# EAGLE design PDD (EAGLE 6.2)
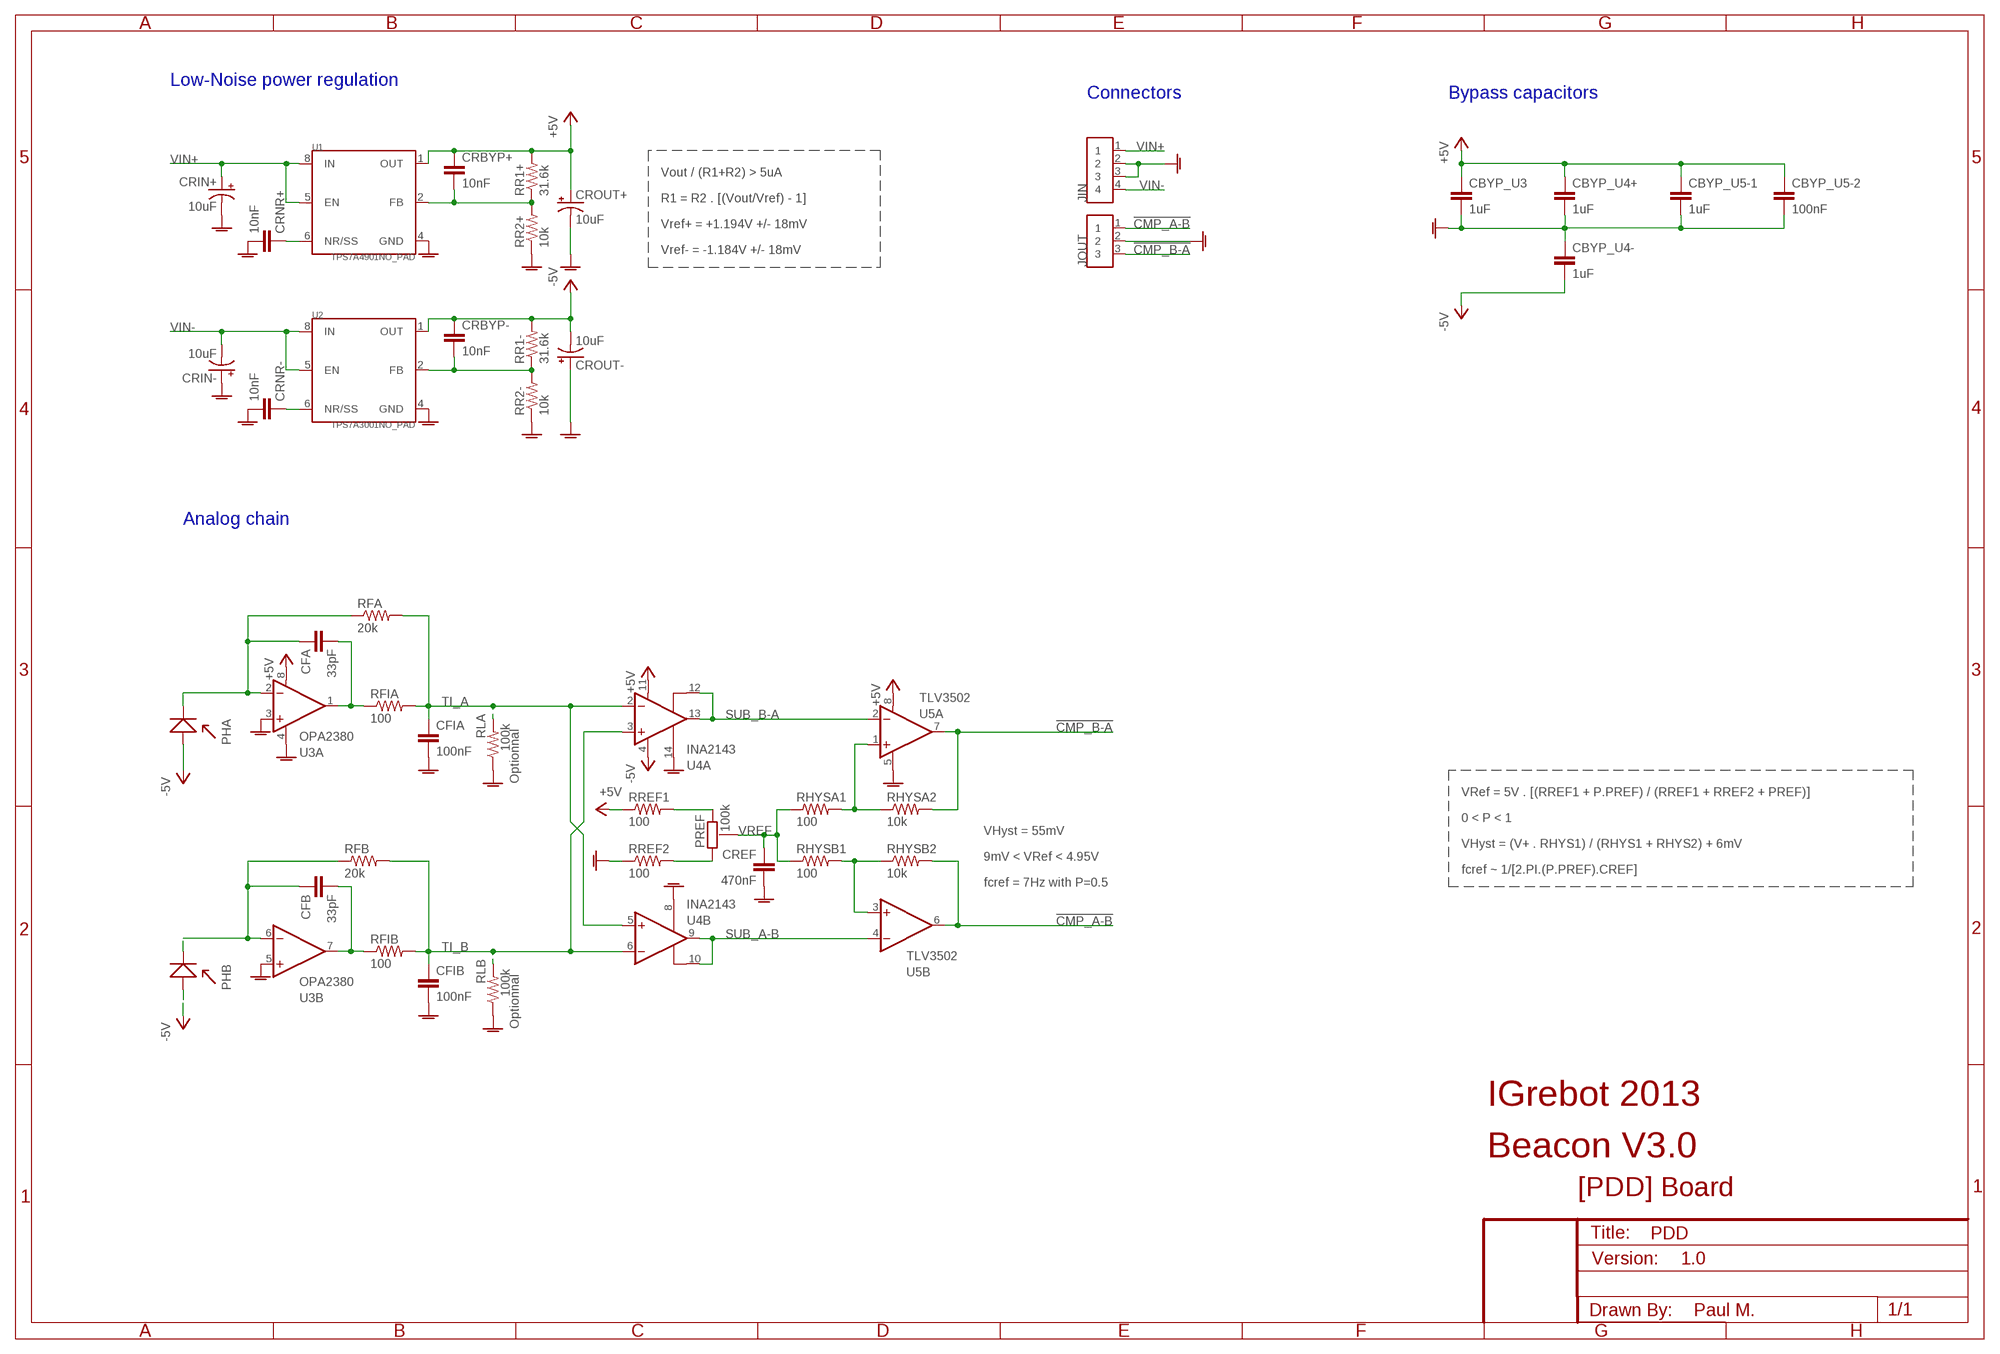
[diagram p0: schematic, sheet 1]

## Parts
CBYP_U3  1uF  CAP0603-CAP  [0603-CAP]
CBYP_U4+  1uF  CAP0603-CAP  [0603-CAP]
CBYP_U4-  1uF  CAP0603-CAP  [0603-CAP]
CBYP_U5-1  1uF  CAP0603-CAP  [0603-CAP]
CBYP_U5-2  100nF  CAP0603-CAP  [0603-CAP]
CFA  33pF  CAP0603-CAP  [0603-CAP]
CFB  33pF  CAP0603-CAP  [0603-CAP]
CFIA  100nF  CAP0603-CAP  [0603-CAP]
CFIB  100nF  CAP0603-CAP  [0603-CAP]
CRBYP+  10nF  CAP0603-CAP  [0603-CAP]
CRBYP-  10nF  CAP0603-CAP  [0603-CAP]
CREF  470nF  CAP0603-CAP  [0603-CAP]
CRIN+  10uF  CAP_POL3528-KIT  [EIA3528-KIT]
CRIN-  10uF  CAP_POL3528-KIT  [EIA3528-KIT]
CRNR+  10nF  CAP0603-CAP  [0603-CAP]
CRNR-  10nF  CAP0603-CAP  [0603-CAP]
CROUT+  10uF  CAP_POL3528-KIT  [EIA3528-KIT]
CROUT-  10uF  CAP_POL3528-KIT  [EIA3528-KIT]
JIN  SIL4  [CON4-2.54]
JOUT  SIL3  [CON3-2.54]
PHA  VBPW34SR  [VBPW34SR]
PHB  VBPW34SR  [VBPW34SR]
PREF  100k  PVZ2A  [TRIM-PVZ2A]
RFA  20k  RESISTOR0603-RES  [0603-RES]
RFB  20k  RESISTOR0603-RES  [0603-RES]
RFIA  100  RESISTOR0603-RES  [0603-RES]
RFIB  100  RESISTOR0603-RES  [0603-RES]
RHYSA1  100  RESISTOR0603-RES  [0603-RES]
RHYSA2  10k  RESISTOR0603-RES  [0603-RES]
RHYSB1  100  RESISTOR0603-RES  [0603-RES]
RHYSB2  10k  RESISTOR0603-RES  [0603-RES]
RLA  100k  RESISTOR0603-RES  [0603-RES]
RLB  100k  RESISTOR0603-RES  [0603-RES]
RR1+  31.6k  RESISTOR0603-RES  [0603-RES]
RR1-  31.6k  RESISTOR0603-RES  [0603-RES]
RR2+  10k  RESISTOR0603-RES  [0603-RES]
RR2-  10k  RESISTOR0603-RES  [0603-RES]
RREF1  100  RESISTOR0603-RES  [0603-RES]
RREF2  100  RESISTOR0603-RES  [0603-RES]
U1  TPS7A4901NO_PAD  [MSOP8]
U2  TPS7A3001NO_PAD  [MSOP8]
U3  OPA2380  [MSOP8]
U4  INA2143  [SOIC14]
U5  TLV3502  [SOIC8]

## Nets
!CMP_A-B!: JOUT.1 RHYSB2.2 U5.6(B:OUT)
!CMP_B-A!: JOUT.3 RHYSA2.2 U5.7(A:OUT)
+5V: CBYP_U3.1 CBYP_U4+.1 CBYP_U5-1.1 CBYP_U5-2.1 CRBYP+.1 CROUT+.A(+) RR1+.2 RREF1.1 U1.1(OUT) U3.8(A:V+) U4.11(A:V+) U5.8(A:V+)
-5V: CBYP_U4-.2 CRBYP-.1 CROUT-.C(-) PHA.A PHB.A RR1-.2 U2.1(OUT) U4.4(A:V-)
AGND: CBYP_U3.2 CBYP_U4+.2 CBYP_U4-.1 CBYP_U5-1.2 CBYP_U5-2.2 CFIA.2 CFIB.2 CREF.2 CRIN+.C(-) CRIN-.A(+) CRNR+.2 CRNR-.2 CROUT+.C(-) CROUT-.A(+) JIN.2 JIN.3 JOUT.2 RLA.1 RLB.1 RR2+.1 RR2-.1 RREF2.1 U1.4(GND) U2.4(GND) U3.3(A:+IN) U3.4(A:V-) U3.5(B:+IN) U4.8(B:REF) U4.14(A:REF) U5.5(A:V-)
N$1: CRNR+.1 U1.6(NR/SS)
N$2: CRBYP-.2 RR1-.1 RR2-.2 U2.2(FB)
N$3: CFA.2 RFIA.1 U3.1(A:OUT)
N$4: CRNR-.1 U2.6(NR/SS)
N$5: CFA.1 PHA.K RFA.1 U3.2(A:-IN)
N$6: CFB.2 RFIB.1 U3.7(B:OUT)
N$7: CRBYP+.2 RR1+.1 RR2+.2 U1.2(FB)
N$8: CFB.1 PHB.K RFB.1 U3.6(B:-IN)
N$14: RHYSA1.2 RHYSA2.1 U5.1(A:+IN)
N$15: RHYSB1.2 RHYSB2.1 U5.3(B:+IN)
N$17: PREF.1(A) RREF1.2
N$18: PREF.3(C) RREF2.2
SUB_A-B: U4.9(B:OUT) U4.10(B:SENSE) U5.4(B:-IN)
SUB_B-A: U4.12(A:SENSE) U4.13(A:OUT) U5.2(A:-IN)
TI_A: CFIA.1 RFA.2 RFIA.2 RLA.2 U4.2(A:-IN) U4.5(B:+IN)
TI_B: CFIB.1 RFB.2 RFIB.2 RLB.2 U4.3(A:+IN) U4.6(B:-IN)
VIN+: CRIN+.A(+) JIN.1 U1.5(EN) U1.8(IN)
VIN-: CRIN-.C(-) JIN.4 U2.5(EN) U2.8(IN)
VREF: CREF.1 PREF.2(B) RHYSA1.1 RHYSB1.1

## Notes on the sheet
- Low-Noise power regulation
- Connectors | Bypass capacitors
- Vout / (R1+R2) > 5uA
- R1 = R2 . [(Vout/Vref) - 1]
- Vref+ = +1.194V +/- 18mV
- Vref- = -1.184V +/- 18mV
- Analog chain
- Optionnal
- VRef = 5V . [(RREF1 + P.PREF) / (RREF1 + RREF2 + PREF)]
- 0 < P < 1
- VHyst = 55mV
- VHyst = (V+ . RHYS1) / (RHYS1 + RHYS2) + 6mV
- 9mV < VRef < 4.95V
- fcref ~ 1/[2.PI.(P.PREF).CREF]
- fcref = 7Hz with P=0.5
- Optionnal
- IGrebot 2013
- Beacon V3.0
- [PDD] Board
- 1.0
- Paul M.

## Library data of the parts
CBYP_U3 CBYP_U4+ CBYP_U4- CBYP_U5-1 CBYP_U5-2 CFA CFB CFIA CFIB CRBYP+ CRBYP- CREF CRNR+ CRNR- = SparkFun-Passives:CAP: Capacitor Standard 0603 ceramic capacitor, and 0.1" leaded capacitor.
CRIN+ CRIN- CROUT+ CROUT- = SparkFun-Passives:CAP_POL: Capacitor Polarized These are standard SMD and PTH capacitors. Normally 10uF, 47uF, and 100uF in electrolytic and tantalum varieties. Always verify the external diameter of the through hole cap, it varies with capacity, voltage, and manufacturer. The EIA devices should be standard.
JIN = lib_paul_v6:SIL4
JOUT = lib_paul_v6:SIL3
PHA PHB = lib_paul_v6:VBPW34SR
PREF = lib_paul_v6:PVZ2A
RFA RFB RFIA RFIB RHYSA1 RHYSA2 RHYSB1 RHYSB2 RLA RLB RR1+ RR1- RR2+ RR2- RREF1 RREF2 = SparkFun-Passives:RESISTOR: Resistor Basic schematic elements and footprints for 0603, 1206, and PTH resistors.
U1 = lib_paul_v6:TPS7A4901
U2 = lib_paul_v6:TPS7A3001
U3 = lib_paul_v6:OPA2380
U4 = lib_paul_v6:INA2143
U5 = lib_paul_v6:TLV3502

## Board
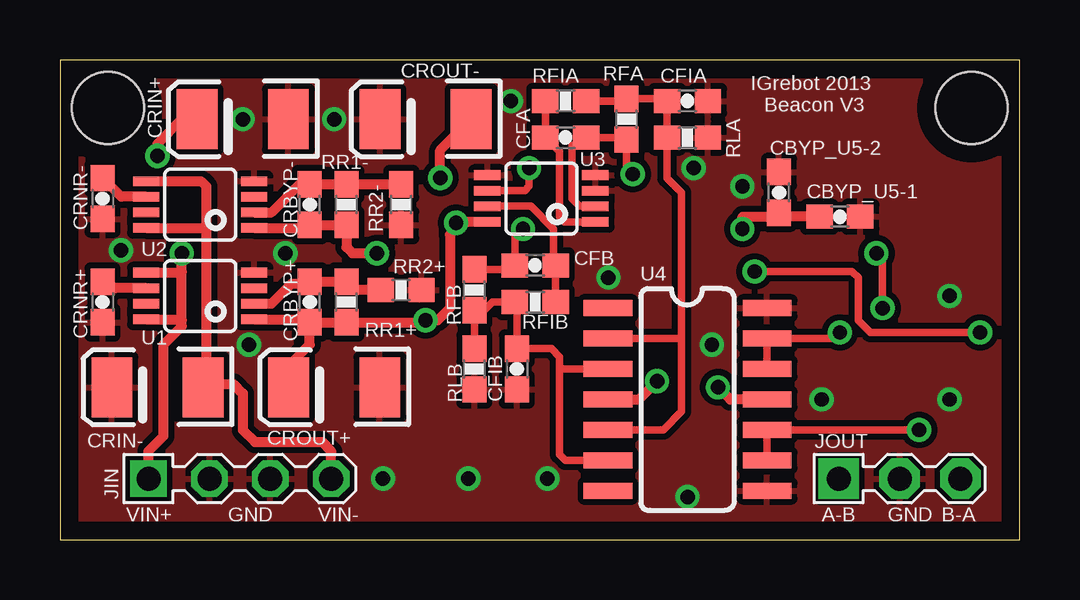
[diagram p1: board, top side]
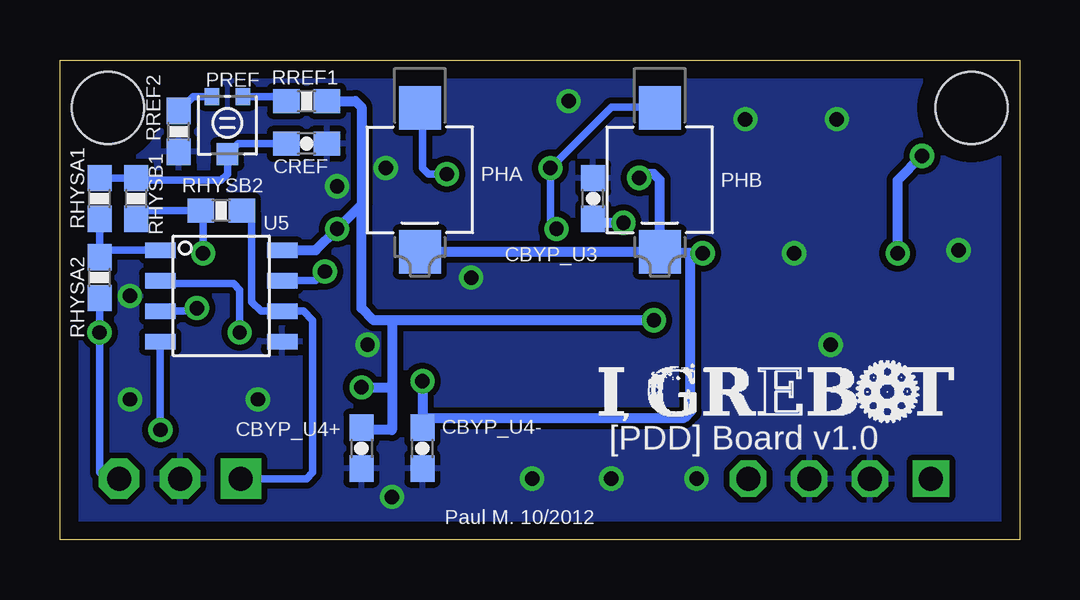
[diagram p2: board, bottom side, seen from below]

Size 40 x 20 mm. Coordinates in mm from the lower left corner, seen from the top.
Outline: 0,0 40,0 40,20 0,20 0,0
Copper layers (1*16): Top 0.035mm / dielectric 1.5mm / Bottom 0.035mm
Design rules: minimum track width 10mil, minimum drill 0.6mm, track to track 8mil, track to pad 8mil, pad to pad 8mil, via to via 8mil, smd to smd 8mil, copper to edge 30mil, drill to drill 10mil, minimum pad ring 10mil, minimum via ring 8mil, stop-mask expansion 4mil, vias tented up to drill 0mil, thermal gap 10mil
Holes 3 mm at 38,18 2,18

### Footprints (pad centres in the part's own frame; a part is rotated, then mirrored left to right if it is on the bottom)
0603-CAP = smd 1.1 x 1: 1 -0.85,0; 2 0.85,0
EIA3528-KIT = smd 1.7 x 2.5: A 1.9,0; C -1.9,0
CON4-2.54 = drill 1 square: 1 -3.81,0 | drill 1 octagon: 2 -1.27,0; 3 1.27,0; 4 3.81,0
CON3-2.54 = drill 1 pad 1.676 square: 1 -2.54,0 | drill 1 pad 1.676 octagon: 2 0,0; 3 2.54,0
VBPW34SR = smd 1.8 x 1.75: A -3,0; K 3,0
TRIM-PVZ2A = smd 0.6 x 0.7: 1 -0.65,-1.2; 3 0.65,-1.2 | smd 0.9 x 0.9: 2 0,1.2
0603-RES = smd 1.1 x 1: 1 -0.85,0; 2 0.85,0
MSOP8 = smd 0.4 x 1.1: 1 -0.975,-2.25; 2 -0.325,-2.25; 3 0.325,-2.25; 4 0.975,-2.25; 5 0.975,2.25; 6 0.325,2.25; 7 -0.325,2.25; 8 -0.975,2.25
SOIC14 = smd 0.66 x 2.032: 1 -3.81,-3.315; 2 -2.54,-3.315; 3 -1.27,-3.315; 4 0,-3.315; 5 1.27,-3.315; 6 2.54,-3.315; 7 3.81,-3.315; 8 3.81,3.315; 9 2.54,3.315; 10 1.27,3.315; 11 0,3.315; 12 -1.27,3.315; 13 -2.54,3.315; 14 -3.81,3.315
SOIC8 = smd 0.635 x 1.27: 1 -1.905,-2.54; 2 -0.635,-2.54; 3 0.635,-2.54; 4 1.905,-2.54; 5 1.905,2.54; 6 0.635,2.54; 7 -0.635,2.54; 8 -1.905,2.54

### Placement (x,y rotation side)
CBYP_U3  17.78,14.22 90 bottom
CBYP_U4+  27.43,3.81 270 bottom
CBYP_U4-  24.89,3.81 90 bottom
CBYP_U5-1  32.51,13.46 0 top
CBYP_U5-2  29.97,14.48 90 top
CFA  21.08,16.76 180 top
CFB  19.81,11.43 0 top
CFIA  26.16,18.29 0 top
CFIB  19.05,7.11 270 top
CRBYP+  10.41,9.91 90 top
CRBYP-  10.41,13.97 90 top
CREF  29.72,16.51 0 bottom
CRIN+  7.62,17.53 180 top
CRIN-  4.06,6.35 180 top
CRNR+  1.78,9.91 270 top
CRNR-  1.78,14.22 270 top
CROUT+  11.43,6.35 180 top
CROUT-  15.24,17.53 180 top
JIN  7.5,2.54 0 top
JOUT  35,2.54 0 top
PHA  25,15 90 bottom
PHB  15,15 90 bottom
PREF  33.02,17.27 180 bottom
RFA  23.62,17.53 90 top
RFB  17.27,10.41 270 top
RFIA  21.08,18.29 0 top
RFIB  19.81,9.91 180 top
RHYSA1  38.35,14.22 270 bottom
RHYSA2  38.35,10.92 270 bottom
RHYSB1  36.83,14.22 270 bottom
RHYSB2  33.27,13.72 0 bottom
RLA  26.16,16.76 180 top
RLB  17.27,7.11 90 top
RR1+  11.94,9.91 270 top
RR1-  11.94,13.97 270 top
RR2+  14.22,10.41 180 top
RR2-  14.22,13.97 90 top
RREF1  29.72,18.29 180 bottom
RREF2  35.05,17.02 90 bottom
U1  5.84,10.16 90 top
U2  5.84,13.97 90 top
U3  20.07,14.22 90 top
U4  26.16,5.84 270 top
U5  33.27,10.16 270 bottom

### Tracks (layer width: path | path; a pad name or v marks a point on that pad's centre or on a via)
!CMP_A-B!
  Bottom 0.305: RHYSB2.2 32,13.55 32,9.91 31.62,9.53 U5.6 29.84,9.53 29.46,9.14 29.46,2.79 29.72,2.54 JOUT.1
!CMP_B-A!  (via drill 0.6)
  Top 0.305: v28.96,11.18 33.02,11.18 33.27,10.92 33.27,9.14 33.78,8.64 v38.35,8.64
  Bottom 0.305: U5.7 29.34,10.79 v28.96,11.18 | RHYSA2.2 v38.35,8.64 38.35,2.79 38.1,2.54 JOUT.3
+5V  (via drill 0.6)
  Top 0.406: U1.1 10.29,9.19 CRBYP+.1 | CRBYP+.1 RR1+.2 14.9,9.06 v15.24,9.14 15.75,9.14 16.26,9.65 16.26,12.7 v16.51,13.21 16.55,13.25 U3.8 | CROUT+.A 9.53,7.24 10.41,8.13 CRBYP+.1 | CBYP_U5-1.1 30.14,13.46 CBYP_U5-2.1 29.81,13.46 28.45,13.46 v28.45,12.95 | U4.11 27.94,5.84 v27.43,6.35
  Bottom 0.406: U5.8 29.34,12.06 v28.45,12.95 27.43,13.97 | RREF1.1 27.69,18.29 27.43,18.03 27.43,13.97 | v15.24,9.14 26.16,9.14 | 26.16,9.14 26.92,9.14 27.43,9.65 27.43,13.97 | 26.16,9.14 26.16,6.35 | 26.16,6.35 26.16,4.57 27.34,4.57 CBYP_U4+.1 | v27.43,6.35 26.16,6.35 | v16.51,13.21 17.61,13.21 CBYP_U3.1
-5V  (via drill 0.6)
  Top 0.406: U2.1 10.29,12.99 CRBYP-.1 RR1-.2 11.94,12.19 12.19,11.94 v13.21,11.94 | 17.14,17.39 CROUT-.C 15.85,16.24 v15.85,15.09 | U4.4 24.13,5.84 v24.89,6.6
  Bottom 0.406: 24.4,12.6 PHA.A PHB.A | v24.89,6.6 24.89,5.08 | 24.89,5.08 CBYP_U4-.2 | 24.89,5.08 13.97,5.08 13.72,5.33 13.72,11.94 | PHB.A 14.94,11.94 13.72,11.94 | v13.21,11.94 13.72,11.94 | PHB.A 15,15 15.24,15.24 15.7,15.24 v15.85,15.09
AGND  (via drill 0.6)
  other vias: 13.46,2.54 17.02,2.54 20.32,2.54 31.75,5.84 26.16,1.78 27.18,8.13 37.08,5.84 37.08,10.16 7.62,17.53 11.43,17.53 7.87,8.13 9.4,11.94 28.45,14.73 22.86,10.92 26.42,15.49 2.54,12.06 18.8,18.29
  pour Top (isolate 0.254): 0,0 40.13,0 40.13,20.07 0,20.07
  pour Bottom (isolate 0.254): 0,0 40.13,0 40.13,20.07 0,20.07
N$1
  Top 0.406: U1.6 2.3,10.48 CRNR+.1
N$2
  Top 0.406: U2.2 8.82,13.64 9.99,14.82 CRBYP-.2 RR1-.1 RR2-.2
N$3
  Top 0.305: U3.1 21.04,13.25 20.83,13.46 20.83,16.17 CFA.2 RFIA.1
N$4
  Top 0.406: U2.6 2.56,14.29 CRNR-.1
N$5  (via drill 0.6)
  Top 0.305: U3.2 21.66,13.9 21.34,14.22 21.34,16.42 CFA.1 23.53,16.76 RFA.1 23.62,15.49 v23.88,15.24
  Bottom 0.305: v23.88,15.24 24.64,15.24 24.89,15.49 24.89,17.89 PHA.K
N$6
  Top 0.305: U3.7 19.63,13.9 20.57,12.95 20.57,11.52 CFB.2 RFIB.1
N$7
  Top 0.406: U1.2 8.82,9.84 9.65,10.67 10.33,10.67 CRBYP+.2 RR1+.1 12.28,10.41 RR2+.2
N$8  (via drill 0.6)
  Top 0.305: U3.6 19.38,14.55 19.56,14.73 v19.56,15.49 | v19.3,12.95 18.96,12.61 CFB.1 18.8,11.26 RFB.1
  Bottom 0.305: v19.3,12.95 19.56,13.21 v19.56,15.49 17.02,18.03 15.03,18.03 PHB.K
N$14
  Bottom 0.305: RHYSA1.2 RHYSA2.1 38.06,12.06 U5.1
N$15  (via drill 0.6)
  Top 0.305: v34.29,9.65 34.29,11.68 v34.04,11.94
  Bottom 0.305: RHYSB1.2 36.49,13.72 RHYSB2.1 34.04,13.63 v34.04,11.94 | U5.3 34.42,9.53 v34.29,9.65
N$17
  Bottom 0.305: PREF.1 30.75,18.47 RREF1.2
N$18
  Bottom 0.305: PREF.3 34.45,18.47 RREF2.2
SUB_A-B  (via drill 0.6)
  Top 0.305: U4.9 U4.10 v35.81,4.57
  Bottom 0.305: v35.81,4.57 U5.4
SUB_B-A  (via drill 0.6)
  Top 0.305: U4.12 U4.13 32.26,8.38 v32.51,8.64
  Bottom 0.305: U5.2 35.69,10.67 32.77,10.67 32.51,10.41 v32.51,8.64
TI_A
  Top 0.305: RFIA.2 23.53,18.29 RFA.2 25.22,18.38 CFIA.1 RLA.2 25.31,15.07 25.91,14.48 25.91,8.38 | 25.91,8.38 U4.2 | U4.5 25.15,4.57 25.91,5.33 25.91,8.38
TI_B
  Top 0.305: RFIB.2 18.03,9.91 17.69,9.56 RFB.2 RLB.2 | 18.71,9.65 RFIB.2 | 20.83,7.11 U4.3 | U4.6 21.08,3.3 20.83,3.56 20.83,7.11 | RFIB.2 19.05,9.82 CFIB.1 20.49,7.96 20.83,7.62 20.83,7.11
VIN+  (via drill 0.6)
  Top 0.406: JIN.1 3.69,3.69 4.32,4.32 4.32,8.13 5.08,8.89 5.08,9.14 | 5.08,9.14 5.08,11.18 | 5.08,11.18 v5.08,11.94 | v4.06,16 4.06,16.51 5.08,17.53 CRIN+.A | U1.5 5.04,11.13 5.08,11.18 | U1.8 5.04,9.19 5.08,9.14
  Bottom 0.406: v5.08,11.94 5.08,14.99 v4.06,16
VIN-
  Top 0.406: U2.5 5.88,14.95 6.1,14.73 6.1,12.95 | 6.1,12.95 6.1,6.48 | 6.1,6.48 CRIN-.C | U2.8 6.05,12.99 6.1,12.95 | 6.1,6.48 7.23,6.48 7.62,6.1 7.62,4.57 8.13,4.06 10.92,4.06 11.31,3.68 JIN.4
VREF
  Bottom 0.305: RHYSA1.1 RHYSB1.1 36.74,14.99 33.27,14.99 33.02,15.24 PREF.2 32.58,16.51 CREF.1

### Text on the board
tNames: IGrebot 2013 | Beacon V3 | VIN+ | GND | VIN- | A-B | GND | B-A
bNames: [PDD] Board v1.0 | Paul M. 10/2012